# Altium schematic sheet Shem_Supply_Valvulado 2.0.SchDoc
size A4
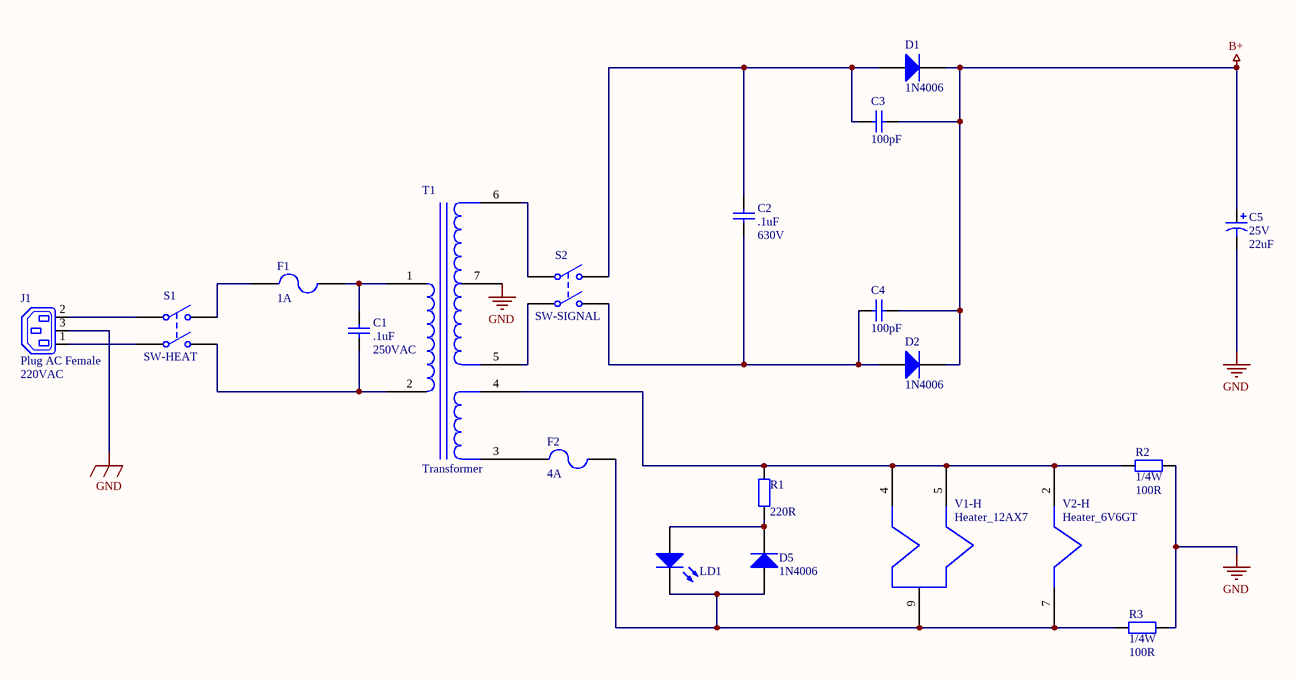
[diagram p0: Shem_Supply_Valvulado 2.0.SchDoc]

## Parts
C1  250VAC  value .1uF  [RAD-0.3]
C2  630V  value .1uF  [RAD-0.4]
C3  value 100pF  [RAD-0.2]
C4  value 100pF  [RAD-0.2]
C5  25V  value 22uF  [RB7.6-15]
D1  1N4006  [DO-41]
D2  1N4006  [DO-41]
D5  1N4006  [DO-41]
D6  LD1  [LED-0]
F1  1A  [PIN-W2/E2.8]
F2  4A  [PIN-W2/E2.8]
J1  Plug AC Female  Voltage: 220VAC  [IEC7-2H3]
R1  value 220R  [AXIAL-0.4]  (hidden comment: Res2)
R2  1/4W  value 100R  [AXIAL-0.4]
R3  1/4W  value 100R  [AXIAL-0.4]
S1  SW-HEAT  [DPST-4]
S2  SW-SIGNAL  [DPST-4]
T1  Transformer
V1-H  Heater_12AX7
V2-H  Heater_6V6GT

## Nets
B+: C3.2 C4.1 C5.1 D1.2(K) D2.2(K)
GND: C5.2 J1.3(E) R2.2 R3.2 T1.7
NetC1_1: C1.1 S1.4(NO2) T1.2
NetC1_2: C1.2 F1.2 T1.1
NetC2_1: C2.1 C4.2 D2.1(A) S2.4(NO2)
NetC2_2: C2.2 C3.1 D1.1(A) S2.2(NO1)
NetD5_1: D5.1(A) D6.2(K) F2.2 R3.1 V1-H.9 V2-H.7
NetD5_2: D5.2(K) D6.1(A) R1.1
NetF1_1: F1.1 S1.2(NO1)
NetF2_1: F2.1 T1.3
NetJ1_1: J1.1(L) S1.3(COMMON2)
NetJ1_2: J1.2(N) S1.1(COMMON1)
NetR1_2: R1.2 R2.1 T1.4 V1-H.4 V1-H.5 V2-H.2
NetS2_1: S2.1(COMMON1) T1.6
NetS2_3: S2.3(COMMON2) T1.5

## Library data of the parts
C1-C4 = Cap: Capacitor; Published: 8-Jun-2000; LatestRevisionDate: 17-Jul-2002; LatestRevisionNote: Re-released for DXP Platform.; PackageReference: RAD-0.3; Publisher: Altium Limited; PackageDescription: Radial Cap, Thru-Hole; 2 Leads; 0.3 in Pin Spacing
C5 = Cap Pol1: Polarized Capacitor (Radial); Published: 8-Jun-2000; LatestRevisionDate: 17-Jul-2002; LatestRevisionNote: Re-released for DXP Platform.; PackageReference: RB7.6-15; Publisher: Altium Limited; PackageDescription: Polarized Capacitor (Radial); 2 Leads
D1 D2 D5 = Diode 1N4006: 1 Amp General Purpose Rectifier; Published: 8-Jun-2000; LatestRevisionDate: 17-Jul-2002; LatestRevisionNote: Re-released for DXP Platform.; DatasheetVersion: 1998; PackageVersion: Aug-1999; PackageReference: DO-41; Publisher: Altium Limited; PackageDescription: Diode, Axial; Body 5.2 x 2.7 mm (LxDia. max), Lead Dia. 0.86 mm (max); Code_JEDEC: DO-204-AL; ComponentLink1Description: Manufacturer Link; ComponentLink1URL: http://www.fairchildsemi.com/; ComponentLink2Description: Datasheet; ComponentLink2URL: http://www.fairchildsemi.com/ds/1N%2F1N4001.pdf
D6 = LED0: Typical INFRARED GaAs LED; Published: 8-Jun-2000; LatestRevisionDate: 08-Jul-2005; LatestRevisionNote: Mech Layer 1 removed.; PackageReference: LED-0; Publisher: Altium Limited; PackageDescription: LED; 2 Leads
F1 F2 = Fuse 2: Fuse; Published: 8-Jun-2000; LatestRevisionDate: 17-Jul-2002; LatestRevisionNote: Re-released for DXP Platform.; PackageReference: PIN-W2/E2.8; Publisher: Altium Limited; PackageDescription: Thru-Hole; 2 Leads
J1 = Plug AC Female: IEC Mains Power Outlet, EN60 320-2-2 F Class I, PC Flange Rear Mount, Chassis Socket; PackageDocument: ver.80, 15-Sep-2003; MaximumRating: 10A, 250V a.c. (UL & CSA 15A, 250V a.c.); MountingFixtures: Not drawn on schematic symbol.; PCB_Layout: Complies with manufacturer's recommendation.; DrillSize: Corresponds to nominal value.; Published: 15-Jul-2004; LatestRevisionDate: 15-Jul-2004; LatestRevisionNote: Component Replaced & renamed from "Phonejack".; DatasheetDocument: ver.80, 15-Sep-2003; PackageReference: PX0675/PC; Publisher: Altium Limited; Terminations: P.C. Spills; ComponentLink1Description: Manufacturer Link; ComponentLink1URL: http://www.bulgin.co.uk/
R1-R3 = Res2: Resistor; Published: 8-Jun-2000; LatestRevisionDate: 17-Jul-2002; LatestRevisionNote: Re-released for DXP Platform.; PackageReference: AXIAL-0.4; Publisher: Altium Limited; PackageDescription: Axial Device, Thru-Hole; 2 Leads; 0.4 in Pin Spacing
S1 S2 = SW-DPST: Double-Pole, Single-Throw Switch; Published: 24-Mar-1999; LatestRevisionDate: 17-Jul-2002; LatestRevisionNote: Re-released for DXP Platform.; PackageReference: DPST-4; Publisher: Altium Limited; PackageDescription: Switch; 4 Leads
T1 = Trans3